# Altium schematic sheet HYDRA_V3_LINK.SchDoc
size B; SheetNumber: 1; SheetTotal: 5
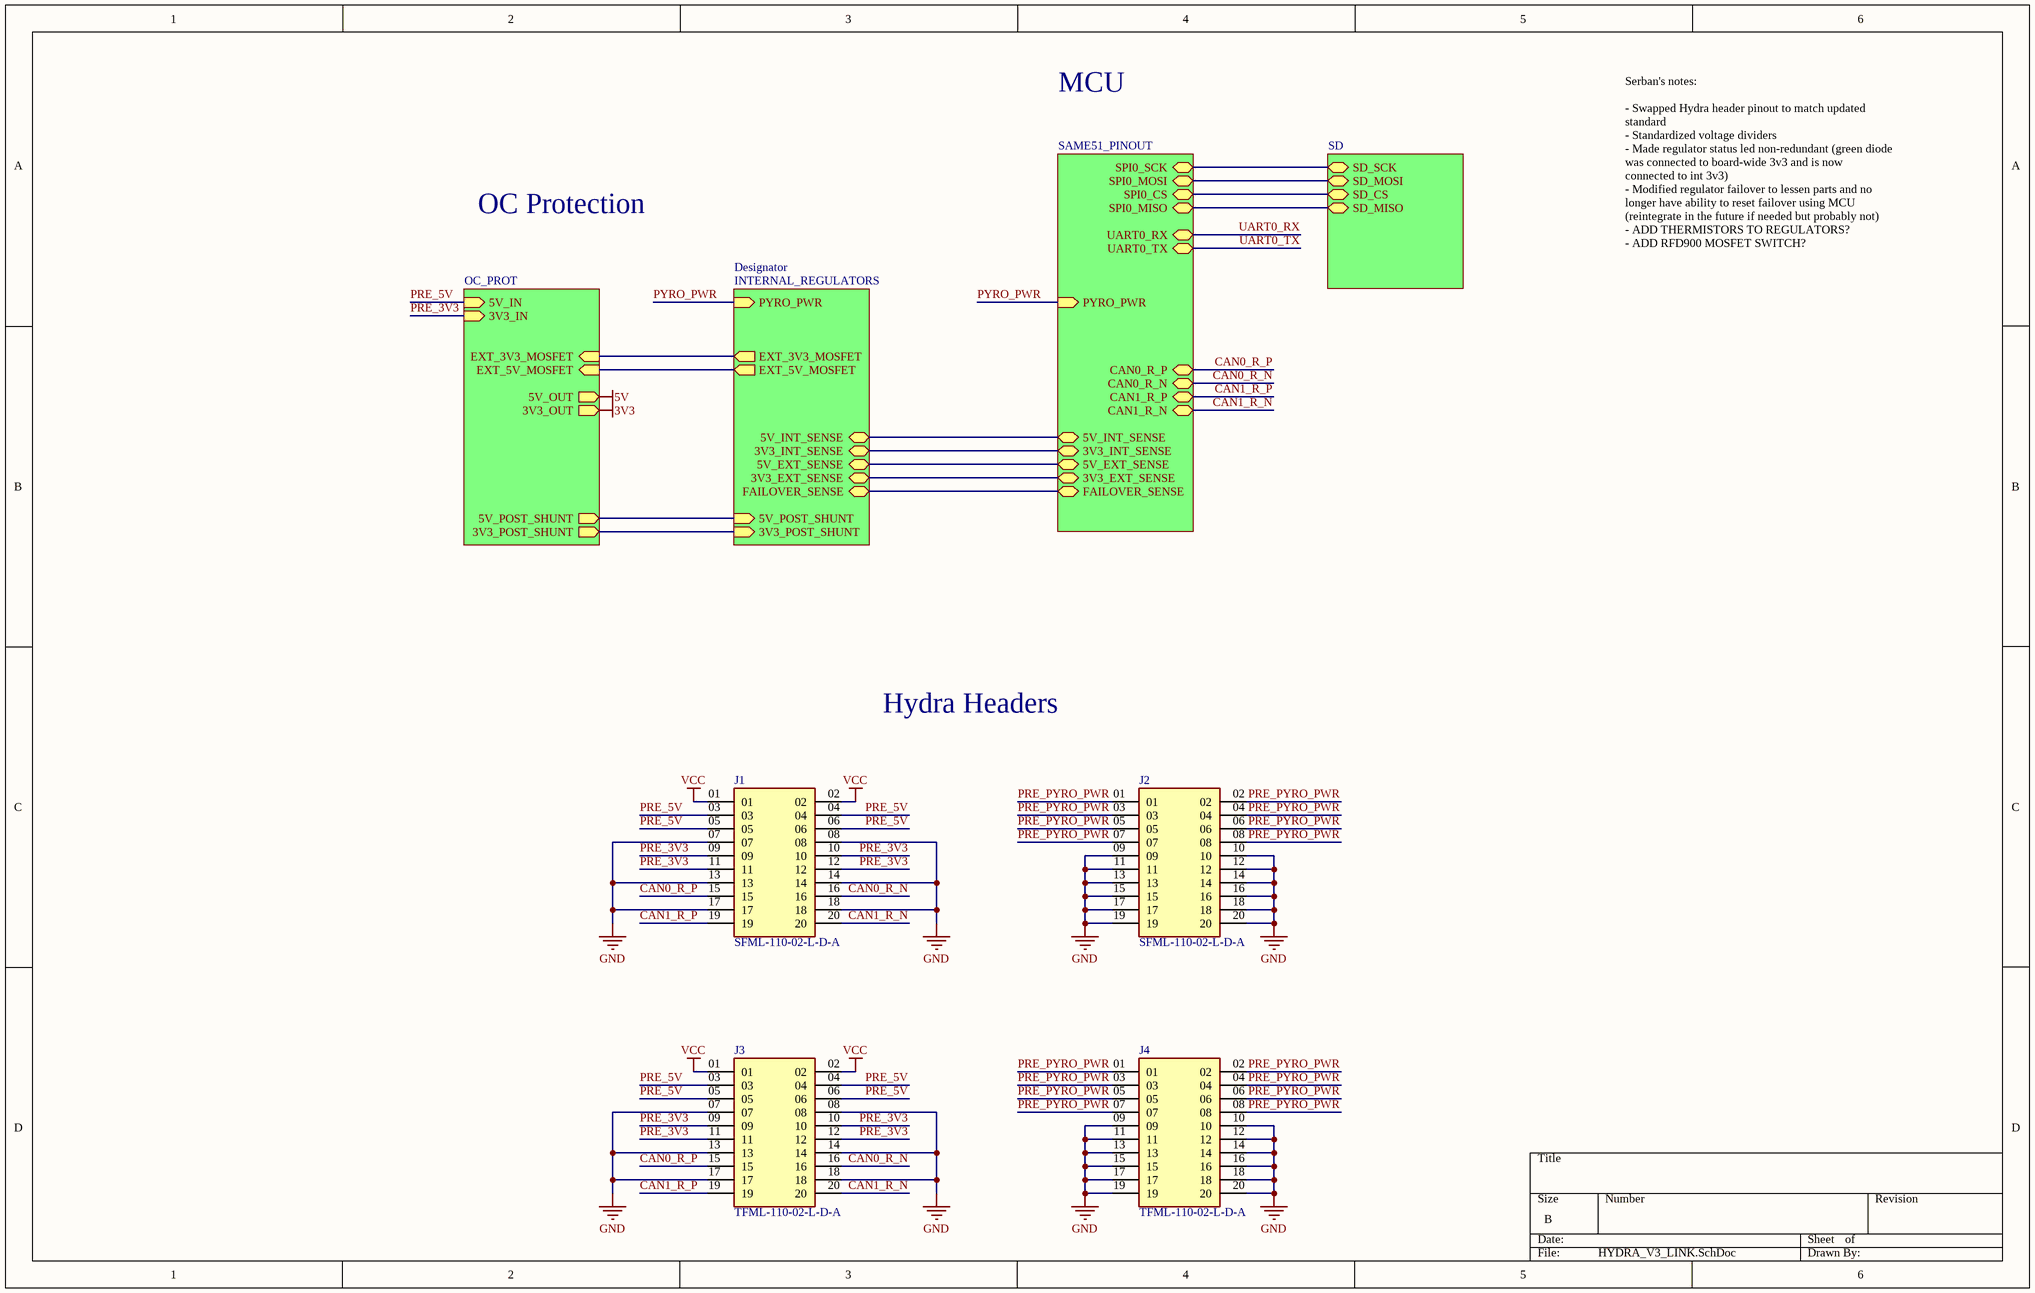
[diagram p0: HYDRA_V3_LINK.SchDoc]

## Parts
J1  SFML-110-02-L-D-A  [SFML-110-02-L-D-A-Footprint-1]
J2  SFML-110-02-L-D-A  [SFML-110-02-L-D-A-Footprint-1]
J3  TFML-110-02-L-D-A  [TFML-110-02-L-D-A-Footprint-1]
J4  TFML-110-02-L-D-A  [TFML-110-02-L-D-A-Footprint-1]

## Sub-sheets
Designator = INTERNAL_REGULATORS: PYRO_PWR (in), 5V_INT_SENSE (bidir), 3V3_INT_SENSE (bidir), 5V_EXT_SENSE (bidir), 3V3_EXT_SENSE (bidir), FAILOVER_SENSE (bidir), EXT_3V3_MOSFET (out), EXT_5V_MOSFET (out), 5V_POST_SHUNT (in), 3V3_POST_SHUNT (in)
MCU_PINOUT = SAME51_PINOUT: CAN0_R_P (bidir), CAN0_R_N (bidir), PYRO_PWR (in), CAN1_R_P (bidir), CAN1_R_N (bidir), SPI0_MISO (bidir), SPI0_MOSI (bidir), SPI0_SCK (bidir), SPI0_CS (bidir), UART0_RX (bidir), UART0_TX (bidir), 5V_INT_SENSE (bidir), 3V3_INT_SENSE (bidir), 5V_EXT_SENSE (bidir), 3V3_EXT_SENSE (bidir), FAILOVER_SENSE (bidir)
OC_PROT = OC_PROT: 5V_OUT (out), 5V_IN (in), 3V3_IN (in), 3V3_OUT (out), EXT_3V3_MOSFET (in), EXT_5V_MOSFET (in), 5V_POST_SHUNT (out), 3V3_POST_SHUNT (out)
SD = SD: SD_SCK (bidir), SD_MOSI (bidir), SD_CS (bidir), SD_MISO (bidir)

## Nets
3V3: sheet OC_PROT/3V3_OUT
5V: sheet OC_PROT/5V_OUT
GND: J1.07 J1.08 J1.13 J1.14 J1.17 J1.18 J2.09 J2.10 J2.11 J2.12 J2.13 J2.14 J2.15 J2.16 J2.17 J2.18 J2.19 J2.20 J3.07 J3.08 J3.13 J3.14 J3.17 J3.18 J4.09 J4.10 J4.11 J4.12 J4.13 J4.14 J4.15 J4.16 J4.17 J4.18 J4.19 J4.20
VCC: J1.01 J1.02 J3.01 J3.02
CAN0_R_N: J1.16 J3.16 ; sheet MCU_PINOUT/CAN0_R_N
CAN0_R_P: J1.15 J3.15 ; sheet MCU_PINOUT/CAN0_R_P
CAN1_R_N: J1.20 J3.20 ; sheet MCU_PINOUT/CAN1_R_N
CAN1_R_P: J1.19 J3.19 ; sheet MCU_PINOUT/CAN1_R_P
PRE_3V3: J1.09 J1.10 J1.11 J1.12 J3.09 J3.10 J3.11 J3.12 ; sheet OC_PROT/3V3_IN
PRE_5V: J1.03 J1.04 J1.05 J1.06 J3.03 J3.04 J3.05 J3.06 ; sheet OC_PROT/5V_IN
PRE_PYRO_PWR: J2.01 J2.02 J2.03 J2.04 J2.05 J2.06 J2.07 J2.08 J4.01 J4.02 J4.03 J4.04 J4.05 J4.06 J4.07 J4.08
PYRO_PWR: sheet MCU_PINOUT/PYRO_PWR, sheet Designator/PYRO_PWR
UART0_RX: sheet MCU_PINOUT/UART0_RX
UART0_TX: sheet MCU_PINOUT/UART0_TX
(unnamed): sheet OC_PROT/EXT_3V3_MOSFET, sheet Designator/EXT_3V3_MOSFET
(unnamed): sheet OC_PROT/EXT_5V_MOSFET, sheet Designator/EXT_5V_MOSFET
(unnamed): sheet OC_PROT/5V_POST_SHUNT, sheet Designator/5V_POST_SHUNT
(unnamed): sheet OC_PROT/3V3_POST_SHUNT, sheet Designator/3V3_POST_SHUNT
(unnamed): sheet MCU_PINOUT/SPI0_MISO, sheet SD/SD_MISO
(unnamed): sheet MCU_PINOUT/SPI0_MOSI, sheet SD/SD_MOSI
(unnamed): sheet MCU_PINOUT/SPI0_SCK, sheet SD/SD_SCK
(unnamed): sheet MCU_PINOUT/SPI0_CS, sheet SD/SD_CS
(unnamed): sheet MCU_PINOUT/5V_INT_SENSE, sheet Designator/5V_INT_SENSE
(unnamed): sheet MCU_PINOUT/3V3_INT_SENSE, sheet Designator/3V3_INT_SENSE
(unnamed): sheet MCU_PINOUT/5V_EXT_SENSE, sheet Designator/5V_EXT_SENSE
(unnamed): sheet MCU_PINOUT/3V3_EXT_SENSE, sheet Designator/3V3_EXT_SENSE
(unnamed): sheet MCU_PINOUT/FAILOVER_SENSE, sheet Designator/FAILOVER_SENSE

## Notes on the sheet
- MCU
- OC Protection
- Serban's notes:
  - Swapped Hydra header pinout to match updated standard
  - Standardized voltage dividers
  - Made regulator status led non-redundant (green diode was connected to board-wide 3v3 and is now connected to int 3v3)
  - Modified regulator failover to lessen parts and no longer have ability to reset failover using MCU (reintegrate in the future if needed but probably not)
  - ADD THERMISTORS TO REGULATORS?
  - ADD RFD900 MOSFET SWITCH?
- Hydra Headers

## Library data of the parts
J1 J2 = CMP-002-00076-2: Headers & Wire Housings .050 Tiger Eye High-Reliability Locking Socket Strip
J3 J4 = CMP-002-00077-1: Conn Shrouded Header (4 Sides) HDR 20 POS 1.27mm Solder ST Top Entry SMD TIGER EYE™ Tube